# Altium schematic sheet Decoder.SchDoc
size A
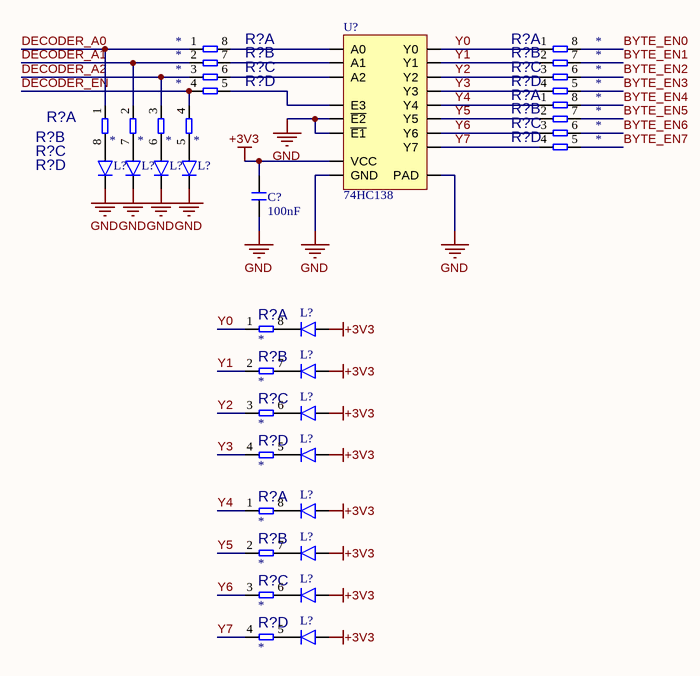
[diagram p0: Decoder.SchDoc]

## Parts
(Parts that share a designator on the sheet are numbered #1, #2 ... from top to bottom, then left to right.)
C?  100nF  [C0603_N]
L?#1  LED  [LED 0603 Reverse]  (value not drawn)
L?#2  LED  [LED 0603 Reverse]  (value not drawn)
L?#3  LED  [LED 0603 Reverse]  (value not drawn)
L?#4  LED  [LED 0603 Reverse]  (value not drawn)
L?#5  LED  [LED 0603 Reverse]  (value not drawn)
L?#6  LED  [LED 0603 Reverse]  (value not drawn)
L?#7  LED  [LED 0603 Reverse]  (value not drawn)
L?#8  LED  [LED 0603 Reverse]  (value not drawn)
L?#9  LED  [LED 0603 Reverse]  (value not drawn)
L?#10  LED  [LED 0603 Reverse]  (value not drawn)
L?#11  LED  [LED 0603 Reverse]  (value not drawn)
L?#12  LED  [LED 0603 Reverse]  (value not drawn)
R?#1  Resistor Array - 4P  [YC164]  (value not drawn)  (part A of 4)
R?#2  Resistor Array - 4P  [YC164]  (value not drawn)  (part A of 4)
R?#3  Resistor Array - 4P  [YC164]  (value not drawn)  (part B of 4)
R?#4  Resistor Array - 4P  [YC164]  (value not drawn)  (part B of 4)
R?#5  Resistor Array - 4P  [YC164]  (value not drawn)  (part C of 4)
R?#6  Resistor Array - 4P  [YC164]  (value not drawn)  (part C of 4)
R?#7  Resistor Array - 4P  [YC164]  (value not drawn)  (part D of 4)
R?#8  Resistor Array - 4P  [YC164]  (value not drawn)  (part D of 4)
R?#9  Resistor Array - 4P  [YC164]  (value not drawn)  (part A of 4)
R?#10  Resistor Array - 4P  [YC164]  (value not drawn)  (part A of 4)
R?#11  Resistor Array - 4P  [YC164]  (value not drawn)  (part B of 4)
R?#12  Resistor Array - 4P  [YC164]  (value not drawn)  (part C of 4)
R?#13  Resistor Array - 4P  [YC164]  (value not drawn)  (part D of 4)
R?#14  Resistor Array - 4P  [YC164]  (value not drawn)  (part B of 4)
R?#15  Resistor Array - 4P  [YC164]  (value not drawn)  (part C of 4)
R?#16  Resistor Array - 4P  [YC164]  (value not drawn)  (part D of 4)
R?#17  Resistor Array - 4P  [YC164]  (value not drawn)  (part A of 4)
R?#18  Resistor Array - 4P  [YC164]  (value not drawn)  (part B of 4)
R?#19  Resistor Array - 4P  [YC164]  (value not drawn)  (part C of 4)
R?#20  Resistor Array - 4P  [YC164]  (value not drawn)  (part D of 4)
R?#21  Resistor Array - 4P  [YC164]  (value not drawn)  (part A of 4)
R?#22  Resistor Array - 4P  [YC164]  (value not drawn)  (part B of 4)
R?#23  Resistor Array - 4P  [YC164]  (value not drawn)  (part C of 4)
R?#24  Resistor Array - 4P  [YC164]  (value not drawn)  (part D of 4)
U?  74HC138  [DHVQFN16]

## Nets
+3V3: C?.1 L?#5.2(A) L?#6.2(A) L?#7.2(A) L?#8.2(A) L?#9.2(A) L?#10.2(A) L?#11.2(A) L?#12.2(A) U?.16(VCC)
GND: C?.2 L?#1.1(K) L?#2.1(K) L?#3.1(K) L?#4.1(K) U?.4(~{E1}) U?.5(~{E2}) U?.8(GND) U?.PAD
BYTE_EN0: R?#2.8
BYTE_EN1: R?#4.7
BYTE_EN2: R?#6.6
BYTE_EN3: R?#8.5
BYTE_EN4: R?#9.8
BYTE_EN5: R?#14.7
BYTE_EN6: R?#15.6
BYTE_EN7: R?#16.5
DECODER_A0: R?#1.1 R?#10.1
DECODER_A1: R?#3.2 R?#11.2
DECODER_A2: R?#5.3 R?#12.3
DECODER_EN: R?#7.4 R?#13.4
Y0: R?#2.1 R?#17.1 U?.15(Y0)
Y1: R?#4.2 R?#18.2 U?.14(Y1)
Y2: R?#6.3 R?#19.3 U?.13(Y2)
Y3: R?#8.4 R?#20.4 U?.12(Y3)
Y4: R?#9.1 R?#21.1 U?.11(Y4)
Y5: R?#14.2 R?#22.2 U?.10(Y5)
Y6: R?#15.3 R?#23.3 U?.9(Y6)
Y7: R?#16.4 R?#24.4 U?.7(Y7)
NetL?#1_2: L?#1.2(A) R?#10.8
NetL?#2_2: L?#2.2(A) R?#11.7
NetL?#3_2: L?#3.2(A) R?#12.6
NetL?#4_2: L?#4.2(A) R?#13.5
NetL?#5_1: L?#5.1(K) R?#17.8
NetL?#6_1: L?#6.1(K) R?#18.7
NetL?#7_1: L?#7.1(K) R?#19.6
NetL?#8_1: L?#8.1(K) R?#20.5
NetL?#9_1: L?#9.1(K) R?#21.8
NetL?#10_1: L?#10.1(K) R?#22.7
NetL?#11_1: L?#11.1(K) R?#23.6
NetL?#12_1: L?#12.1(K) R?#24.5
NetR?#1_8: R?#1.8 U?.1(A0)
NetR?#3_7: R?#3.7 U?.2(A1)
NetR?#5_6: R?#5.6 U?.3(A2)
NetR?#7_5: R?#7.5 U?.6(E3)

## Library data of the parts
C? = Capacitor: Capacitor MLCC; Manufacturer: Yageo; Manufacturer Part Number: CC0603KRX7R9BB104; Tolerance (%): 10; Category: Capacitor; Package: 0603; Value: 100nF; Supplier Part Number 1: 1362556; Supplier 1: Farnell; ComponentLink1URL: http://www.yageo.com; ComponentLink1Description: Manufacturer Website; Voltage Rating (Volts): *; Supplier 2: Digi-Key; Supplier Part Number 2: 311-1344-1-ND
U? = 74HC138: 3 to 8 Decoder
R?#1-R?#24 = Resistor Array - 4P: Value: *